# Altium project Buzzer_22-23.PrjPcb
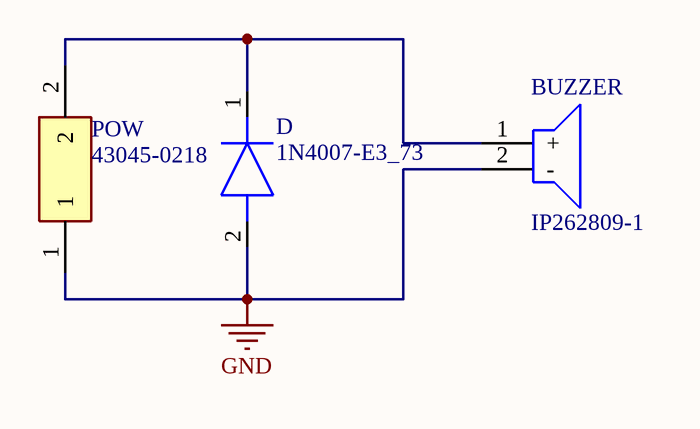
[diagram p0: Buzzer_22-23.SchDoc]
1 sheet, 3 parts. Net scope: global (net labels, ports and power ports of the same name join across sheets).
Board file: Buzzer_22-23.PcbDoc

## Sheet Buzzer_22-23.SchDoc
size A4; SheetNumber: 1; SheetTotal: 1

### Parts
BUZZER  IP262809-1  [IP2628091]
D  1N4007-E3_73  [DIOAD1405W86L465D235]
POW  43045-0218  [43045-02YY_181920]

### Nets
GND: BUZZER.2(-) D.2(A) POW.1
NetBUZZER_1: BUZZER.1(+) D.1(K) POW.2

### Library data of the parts
BUZZER = IP262809-1: Loudspeaker or Buzzer; Manufacturer_Name: DB Unlimited; Datasheet Link: http://www.dbunlimitedco.com/images/product_images/2D-Drawings/IP262809-1.pdf; Height: 22.5mm; Manufacturer_Part_Number: IP262809-1; Mouser Part Number: 497-IP262809-1; Mouser Price/Stock: https://www.mouser.co.uk/ProductDetail/DB-Unlimited/IP262809-1?qs=t9M3m0YJX4PbZshVfFSLcw%3D%3D; Arrow Part Number: IP262809-1; Arrow Price/Stock: https://www.arrow.com/en/products/ip262809-1/db-unlimited
D = 1N4007-E3_73: Diode; Manufacturer_Name: Vishay; Manufacturer_Part_Number: 1N4007-E3/73; Datasheet Link: https://mouser.componentsearchengine.com/Datasheets/2/1N4007-E3_73.pdf; Mouser Part Number: 625-1N4007-E3/73; Mouser Price/Stock: https://www.mouser.co.uk/ProductDetail/Vishay-General-Semiconductor/1N4007-E3-73?qs=N4vtoAxH%2FSqT3Ng3e4K0Gw%3D%3D; Arrow Part Number: 1N4007-E3/73; Arrow Price/Stock: https://www.arrow.com/en/products/1n4007-e373/vishay?region=europe
POW = 43045-0218: Connector; Manufacturer_Name: Molex; Datasheet Link: https://www.molex.com/pdm_docs/sd/430450218_sd.pdf; Height: 9.91mm; Manufacturer_Part_Number: 43045-0218; Mouser Part Number: 538-43045-0218; Mouser Price/Stock: https://www.mouser.co.uk/ProductDetail/Molex/43045-0218?qs=4XSMV6Twtb2qUKINalLbdA%3D%3D; Arrow Part Number: 43045-0218; Arrow Price/Stock: https://www.arrow.com/en/products/43045-0218/molex